# Altium schematic sheet analog_part.SchDoc
size A3
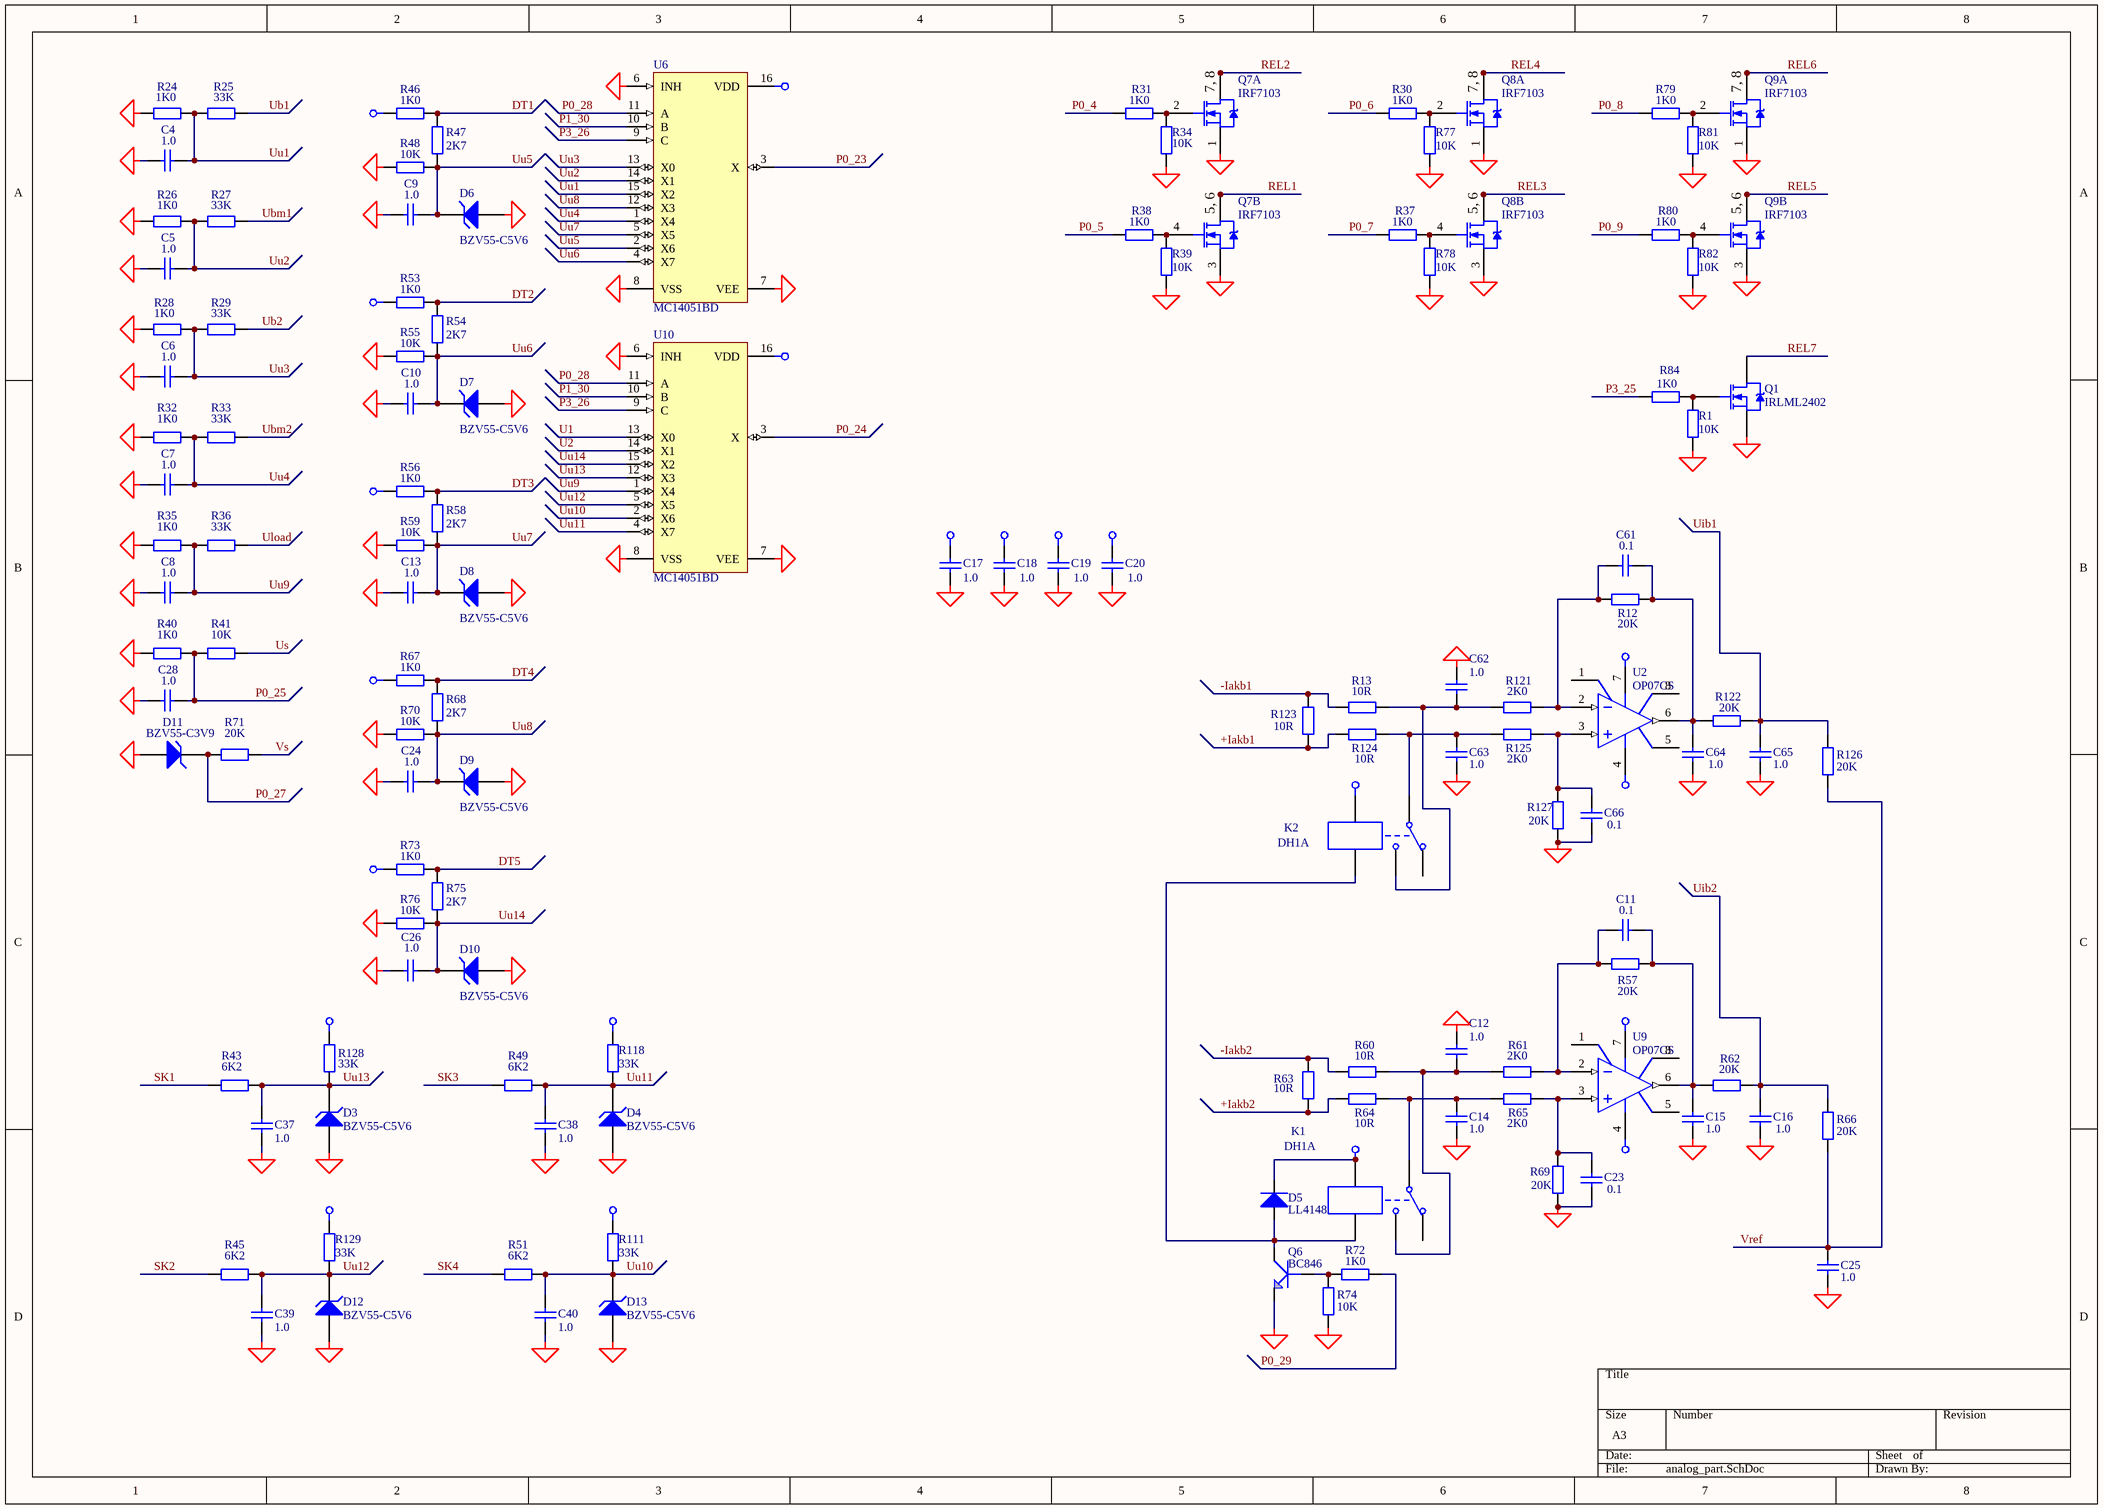
[diagram p0: analog_part.SchDoc]

## Parts
C4  1.0  [_1206]
C5  1.0  [_1206]
C6  1.0  [_1206]
C7  1.0  [_1206]
C8  1.0  [_1206]
C9  1.0  [_1206]
C10  1.0  [_1206]
C11  0.1  [_1206]
C12  1.0  [_1206]
C13  1.0  [_1206]
C14  1.0  [_1206]
C15  1.0  [_1206]
C16  1.0  [_1206]
C17  1.0  [_1206]
C18  1.0  [_1206]
C19  1.0  [_1206]
C20  1.0  [_1206]
C23  0.1  [_1206]
C24  1.0  [_1206]
C25  1.0  [_1206]
C26  1.0  [_1206]
C28  1.0  [_1206]
C37  1.0  [_1206]
C38  1.0  [_1206]
C39  1.0  [_1206]
C40  1.0  [_1206]
C61  0.1  [_1206]
C62  1.0  [_1206]
C63  1.0  [_1206]
C64  1.0  [_1206]
C65  1.0  [_1206]
C66  0.1  [_1206]
D3  BZV55-C5V6  [_1206d]
D4  BZV55-C5V6  [_1206d]
D5  LL4148  [_1206d]
D6  BZV55-C5V6  [_1206d]
D7  BZV55-C5V6  [_1206d]
D8  BZV55-C5V6  [_1206d]
D9  BZV55-C5V6  [_1206d]
D10  BZV55-C5V6  [_1206d]
D11  BZV55-C3V9  [_1206d]
D12  BZV55-C5V6  [_1206d]
D13  BZV55-C5V6  [_1206d]
K1  DH1A  [kuan]
K2  DH1A  [kuan]
Q1  IRLML2402  [SO-G3/Z3.3]
Q6  BC846  [SO-G3]
Q7  IRF7103  [SO-G8/Y2.2]  (parts A,B of 2)
Q8  IRF7103  [SO-G8/Y2.2]  (parts A,B of 2)
Q9  IRF7103  [SO-G8/Y2.2]  (parts A,B of 2)
R1  10K  [_1206]
R12  20K  [_1206]
R13  10R  [_1206]
R24  1K0  [_1206]
R25  33K  [_1206]
R26  1K0  [_1206]
R27  33K  [_1206]
R28  1K0  [_1206]
R29  33K  [_1206]
R30  1K0  [_1206]
R31  1K0  [_1206]
R32  1K0  [_1206]
R33  33K  [_1206]
R34  10K  [_1206]
R35  1K0  [_1206]
R36  33K  [_1206]
R37  1K0  [_1206]
R38  1K0  [_1206]
R39  10K  [_1206]
R40  1K0  [_1206]
R41  10K  [_1206]
R43  6K2  [_1206]
R45  6K2  [_1206]
R46  1K0  [_0805]
R47  2K7  [_1206]
R48  10K  [_1206]
R49  6K2  [_1206]
R51  6K2  [_1206]
R53  1K0  [_0805]
R54  2K7  [_1206]
R55  10K  [_1206]
R56  1K0  [_0805]
R57  20K  [_1206]
R58  2K7  [_1206]
R59  10K  [_1206]
R60  10R  [_1206]
R61  2K0  [_1206]
R62  20K  [_1206]
R63  10R  [_1206]
R64  10R  [_1206]
R65  2K0  [_1206]
R66  20K  [_1206]
R67  1K0  [_0805]
R68  2K7  [_1206]
R69  20K  [_1206]
R70  10K  [_1206]
R71  20K  [_1206]
R72  1K0  [_1206]
R73  1K0  [_0805]
R74  10K  [_1206]
R75  2K7  [_1206]
R76  10K  [_1206]
R77  10K  [_1206]
R78  10K  [_1206]
R79  1K0  [_1206]
R80  1K0  [_1206]
R81  10K  [_1206]
R82  10K  [_1206]
R84  1K0  [_1206]
R111  33K  [_1206]
R118  33K  [_1206]
R121  2K0  [_1206]
R122  20K  [_1206]
R123  10R  [_1206]
R124  10R  [_1206]
R125  2K0  [_1206]
R126  20K  [_1206]
R127  20K  [_1206]
R128  33K  [_1206]
R129  33K  [_1206]
U2  OP07CS  [SO-G8]
U6  MC14051BD  [SO-G16/C5.85]
U9  OP07CS  [SO-G8]
U10  MC14051BD  [SO-G16/C5.85]

## Nets
+3v3: R111.1 R118.1 R128.1 R129.1
+5v: C17.2 C19.2 D5.2(K) K1.4 K2.4 R46.2 R53.2 R56.2 R67.2 R73.2 U2.7(V+) U6.16(VDD) U9.7(V+) U10.16(VDD)
-5v: C18.2 U2.4(V-) U9.4(V-)
GND: C4.2 C5.2 C6.2 C7.2 C8.2 C9.2 C10.2 C12.1 C13.2 C14.1 C15.1 C16.1 C17.1 C18.1 C19.1 C20.1 C23.2 C24.2 C25.1 C26.2 C28.2 C37.2 C38.2 C39.2 C40.2 C62.1 C63.1 C64.1 C65.1 C66.2 D3.1(A) D4.1(A) D6.1(A) D7.1(A) D8.1(A) D9.1(A) D10.1(A) D11.1(A) D12.1(A) D13.1(A) Q1.2(S) Q6.2(E) Q7.1(S) Q7.3(S) Q8.1(S) Q8.3(S) Q9.1(S) Q9.3(S) R1.1 R24.2 R26.2 R28.2 R32.2 R34.1 R35.2 R39.1 R40.2 R48.1 R55.1 R59.1 R69.1 R70.1 R74.1 R76.1 R77.1 R78.1 R81.1 R82.1 R127.1 U6.6(INH) U6.7(VEE) U6.8(VSS) U10.6(INH) U10.7(VEE) U10.8(VSS)
Vref: C20.2 C25.2 R66.2 R126.2
+Iakb1: R123.1 R124.2
+Iakb2: R63.1 R64.2
-Iakb1: R13.2 R123.2
-Iakb2: R60.2 R63.2
DT1: R46.1 R47.1
DT2: R53.1 R54.1
DT3: R56.1 R58.1
DT4: R67.1 R68.1
DT5: R73.1 R75.1
P0_4: R31.1
P0_5: R38.1
P0_6: R30.1
P0_7: R37.1
P0_8: R79.1
P0_9: R80.1
P0_23: U6.3(X)
P0_24: U10.3(X)
P0_25: C28.1 R40.1 R41.1
P0_27: D11.2(K) R71.1
P0_28: U6.11(A) U10.11(A)
P0_29: R72.1
P1_30: U6.10(B) U10.10(B)
P3_25: R84.1
P3_26: U6.9(C) U10.9(C)
REL1: Q7.5(D) Q7.6(D)
REL2: Q7.7(D) Q7.8(D)
REL3: Q8.5(D) Q8.6(D)
REL4: Q8.7(D) Q8.8(D)
REL5: Q9.5(D) Q9.6(D)
REL6: Q9.7(D) Q9.8(D)
REL7: Q1.3(D)
SK1: R43.1
SK2: R45.1
SK3: R49.1
SK4: R51.1
U1: U10.13(X0)
U2: U10.14(X1)
Ub1: R25.2
Ub2: R29.2
Ubm1: R27.2
Ubm2: R33.2
Uib1: C65.2 R122.2 R126.1
Uib2: C16.2 R62.2 R66.1
Uload: R36.2
Us: R41.2
Uu1: C4.1 R24.1 R25.1 U6.15(X2)
Uu2: C5.1 R26.1 R27.1 U6.14(X1)
Uu3: C6.1 R28.1 R29.1 U6.13(X0)
Uu4: C7.1 R32.1 R33.1 U6.1(X4)
Uu5: C9.1 D6.2(K) R47.2 R48.2 U6.2(X6)
Uu6: C10.1 D7.2(K) R54.2 R55.2 U6.4(X7)
Uu7: C13.1 D8.2(K) R58.2 R59.2 U6.5(X5)
Uu8: C24.1 D9.2(K) R68.2 R70.2 U6.12(X3)
Uu9: C8.1 R35.1 R36.1 U10.1(X4)
Uu10: C40.1 D13.2(K) R51.2 R111.2 U10.2(X6)
Uu11: C38.1 D4.2(K) R49.2 R118.2 U10.4(X7)
Uu12: C39.1 D12.2(K) R45.2 R129.2 U10.5(X5)
Uu13: C37.1 D3.2(K) R43.2 R128.2 U10.12(X3)
Uu14: C26.1 D10.2(K) R75.2 R76.2 U10.15(X2)
Vs: R71.2
NetC11_1: C11.1 C15.2 R57.2 R62.1 U9.6(OUT)
NetC11_2: C11.2 R57.1 R61.2 U9.2(IN-)
NetC12_2: C12.2 K1.3 R60.1 R61.1
NetC14_2: C14.2 K1.1 R64.1 R65.1
NetC23_1: C23.1 R65.2 R69.2 U9.3(IN+)
NetC61_1: C61.1 C64.2 R12.2 R122.1 U2.6(OUT)
NetC61_2: C61.2 R12.1 R121.2 U2.2(IN-)
NetC62_2: C62.2 K2.3 R13.1 R121.1
NetC63_2: C63.2 K2.1 R124.1 R125.1
NetC66_1: C66.1 R125.2 R127.2 U2.3(IN+)
NetD5_1: D5.1(A) K1.5 K2.5 Q6.3(C)
NetQ1_1: Q1.1(G) R1.2 R84.2
NetQ6_1: Q6.1(B) R72.2 R74.2
NetQ7_2: Q7.2(G) R31.2 R34.2
NetQ7_4: Q7.4(G) R38.2 R39.2
NetQ8_2: Q8.2(G) R30.2 R77.2
NetQ8_4: Q8.4(G) R37.2 R78.2
NetQ9_2: Q9.2(G) R79.2 R81.2
NetQ9_4: Q9.4(G) R80.2 R82.2

Not connected (* = marked no-connect by the designer): K1 2; K2 2; U2 1(VOSTRIM) 5(NC) 8(VOSTRIM); U9 1(VOSTRIM) 5(NC) 8(VOSTRIM)

## Notes on the sheet
- (in symbol IRF7301, part A) 7, 8
- (in symbol IRF7301, part B) 5, 6

## Library data of the parts
C4-C10 C12-C16 C24-C26 C28 C37-C40 C62-C65 = Cap Semi: Capacitor; Manufacturer: Generic Components; Class I: Passive; Value: 1,0; Published: 8-Jun-2000; Revision: July-2002: Re-released for DXP Platform.; Publisher: Altium Limited; Class II: Capacitor
C11 C17-C20 C23 C61 C66 = Cap Semi: Capacitor; Manufacturer: Generic Components; Class I: Passive; Value: 0,1; Published: 8-Jun-2000; Revision: July-2002: Re-released for DXP Platform.; Publisher: Altium Limited; Class II: Capacitor
D3 D4 D6-D10 D12 D13 = D Zener: Zener Diode; Manufacturer: Generic Components; Class I: Discrete; Class II: Diode - Zener; Value: BZV55C5V6; Published: 8-Jun-2000; Revision: July-2002: Re-released for DXP Platform.; Publisher: Altium Limited
D5 = Diode: Manufacturer: Generic Components; Class I: Discrete; Class II: Diode - Switching; Published: 8-Jun-2000; Revision: July-2002: Re-released for DXP Platform.; Publisher: Altium Limited; Value: LL4148
D11 = D Zener: Zener Diode; Manufacturer: Generic Components; Class I: Discrete; Class II: Diode - Zener; Value: BZV55C3V9; Published: 8-Jun-2000; Revision: July-2002: Re-released for DXP Platform.; Publisher: Altium Limited
K1 K2 = BS115: Relay; Manufacturer: Generic Components; Class I: Electro-mechanical; Published: 24-Mar-1999; Revision: July-2002: Re-released for DXP Platform.; Publisher: Altium Limited; Class II: Relay; Value: DH1A
Q1 = IRLML2402: HEXFET Power MOSFET; Manufacturer: International Rectifier; Class I: Discrete; Class II: MOSFET - Power; Published: 8-Jun-2000; Revision: July-2002: Re-released for DXP Platform.; Datasheet: Latest Revision: Aug-1997; Package Reference: SOT-23; Publisher: Altium Limited
Q6 = GT122: Bipolar transistor; Right: 20; Bottom: 20; Value: BC846
Q7-Q9 = IRF7301: FET; Manufacturer: International Rectifier; Revision 1: 29-Sep-2000: Re-orientated a 'Drain' pin on first part.; Revision 2: July-2002: Re-released for DXP Platform.; Class I: Discrete; Class II: MOSFET - Power; Published: 8-Jun-2000; Datasheet: Latest Revision: Aug-1997; Package Reference: SOIC8; Publisher: Altium Limited; Value: IRF7103
R1 R13 R24-R41 R43 R45-R49 R51 R53-R56 R58-R60 R63 R64 R67 R68 R70-R73 R75-R82 R123 R124 = Res2: Resistor; Manufacturer: Generic Components; Class I: Passive; Rule: Undefined; Published: 8-Jun-2000; Revision: July-2002: Re-released for DXP Platform.; Publisher: Altium Limited; Class II: Resistor
  R1 R34 R39 R41 R48 R55 R59 R70 R76-R78 R81 R82: Value: 10K
  R13 R60 R63 R64 R123 R124: Value: 10R
  R24 R26 R28 R30-R32 R35 R37 R38 R40 R46 R53 R56 R67 R72 R73 R79 R80: Value: 1K0
  R25 R27 R29 R33 R36: Value: 33K
  R43 R45 R49 R51: Value: 6K2
  R47 R54 R58 R68 R75: Value: 2K7
  R71: Value: 20K
R12 R57 R61 R62 R65 R66 R69 R74 R121 R122 R125-R127 = Res2: Resistor; Manufacturer: Generic Components; Class I: Passive; Published: 8-Jun-2000; Revision: July-2002: Re-released for DXP Platform.; Publisher: Altium Limited; Class II: Resistor
  R12 R57 R62 R66 R69 R122 R126 R127: Value: 20K
  R61 R65 R121 R125: Value: 2K0
  R74: Value: 10K
R84 = Res2: Resistor; Manufacturer: Generic Components; Class I: Passive; Value: 20K; Rule: Undefined; Published: 8-Jun-2000; Revision: July-2002: Re-released for DXP Platform.; Publisher: Altium Limited; Class II: Resistor
R111 R118 R128 R129 = Res2: Resistor; Manufacturer: Generic Components; Class I: Passive; Value: 1K0; Rule: Undefined; Published: 8-Jun-2000; Revision: July-2002: Re-released for DXP Platform.; Publisher: Altium Limited; Class II: Resistor
U2 U9 = OP07CS: Operational Amplifier; Manufacturer: Analog Devices; Note: Pin 5 is not connected.; Published: 8-Jun-2000; Revision: July-2002: Re-released for DXP Platform.; Datasheet: Designer's Reference Manual CD (1992); Package Reference: SO-8B; Publisher: Altium Limited; Class I: Amplifier; Class II: Operational Amplifier; Value: OP07CS
U6 U10 = MC14051BD: Multiplexer; Manufacturer: ON Semiconductor; Class I: Logic; Class II: Multiplexer/Encoder/Selector; Value: 4051; Published: 15-Apr-2002; Package Reference: 751B-05; Publisher: Altium Limited